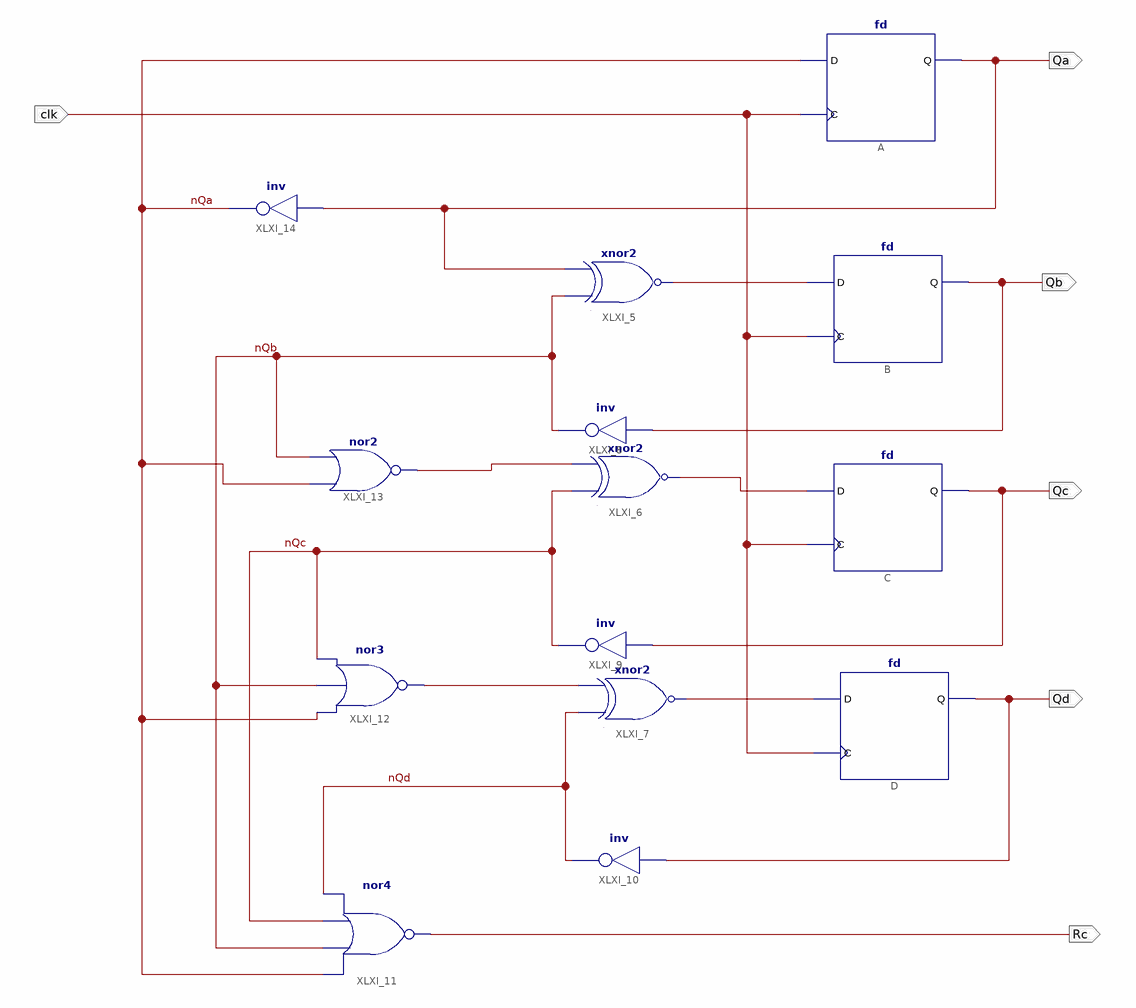
[diagram p0: schematic sheet 1]
// Xilinx ISE schematic Counter_4bit.sch (kintex7) as structural Verilog: 14 symbols, 6 ports
module Counter_4bit (
  input  clk,
  output Qa,
  output Qb,
  output Qc,
  output Qd,
  output Rc
);

  wire nQa, nQb, nQc, nQd, XLXN_9, XLXN_10, XLXN_11, XLXN_20, XLXN_24;

  xnor XLXI_5 (XLXN_9, nQb, Qa);
  xnor XLXI_6 (XLXN_10, nQc, XLXN_24);
  xnor XLXI_7 (XLXN_11, nQd, XLXN_20);
  not XLXI_8 (nQb, Qb);
  not XLXI_9 (nQc, Qc);
  not XLXI_10 (nQd, Qd);
  nor XLXI_11 (Rc, nQa, nQb, nQc, nQd);
  nor XLXI_12 (XLXN_20, nQa, nQb, nQc);
  nor XLXI_13 (XLXN_24, nQa, nQb);
  not XLXI_14 (nQa, Qa);
  fd A (.C(clk), .D(nQa), .Q(Qa));
  fd B (.C(clk), .D(XLXN_9), .Q(Qb));
  fd C (.C(clk), .D(XLXN_10), .Q(Qc));
  fd D (.C(clk), .D(XLXN_11), .Q(Qd));
endmodule
